# EAGLE design module_ktemp (EAGLE 7.2.0)
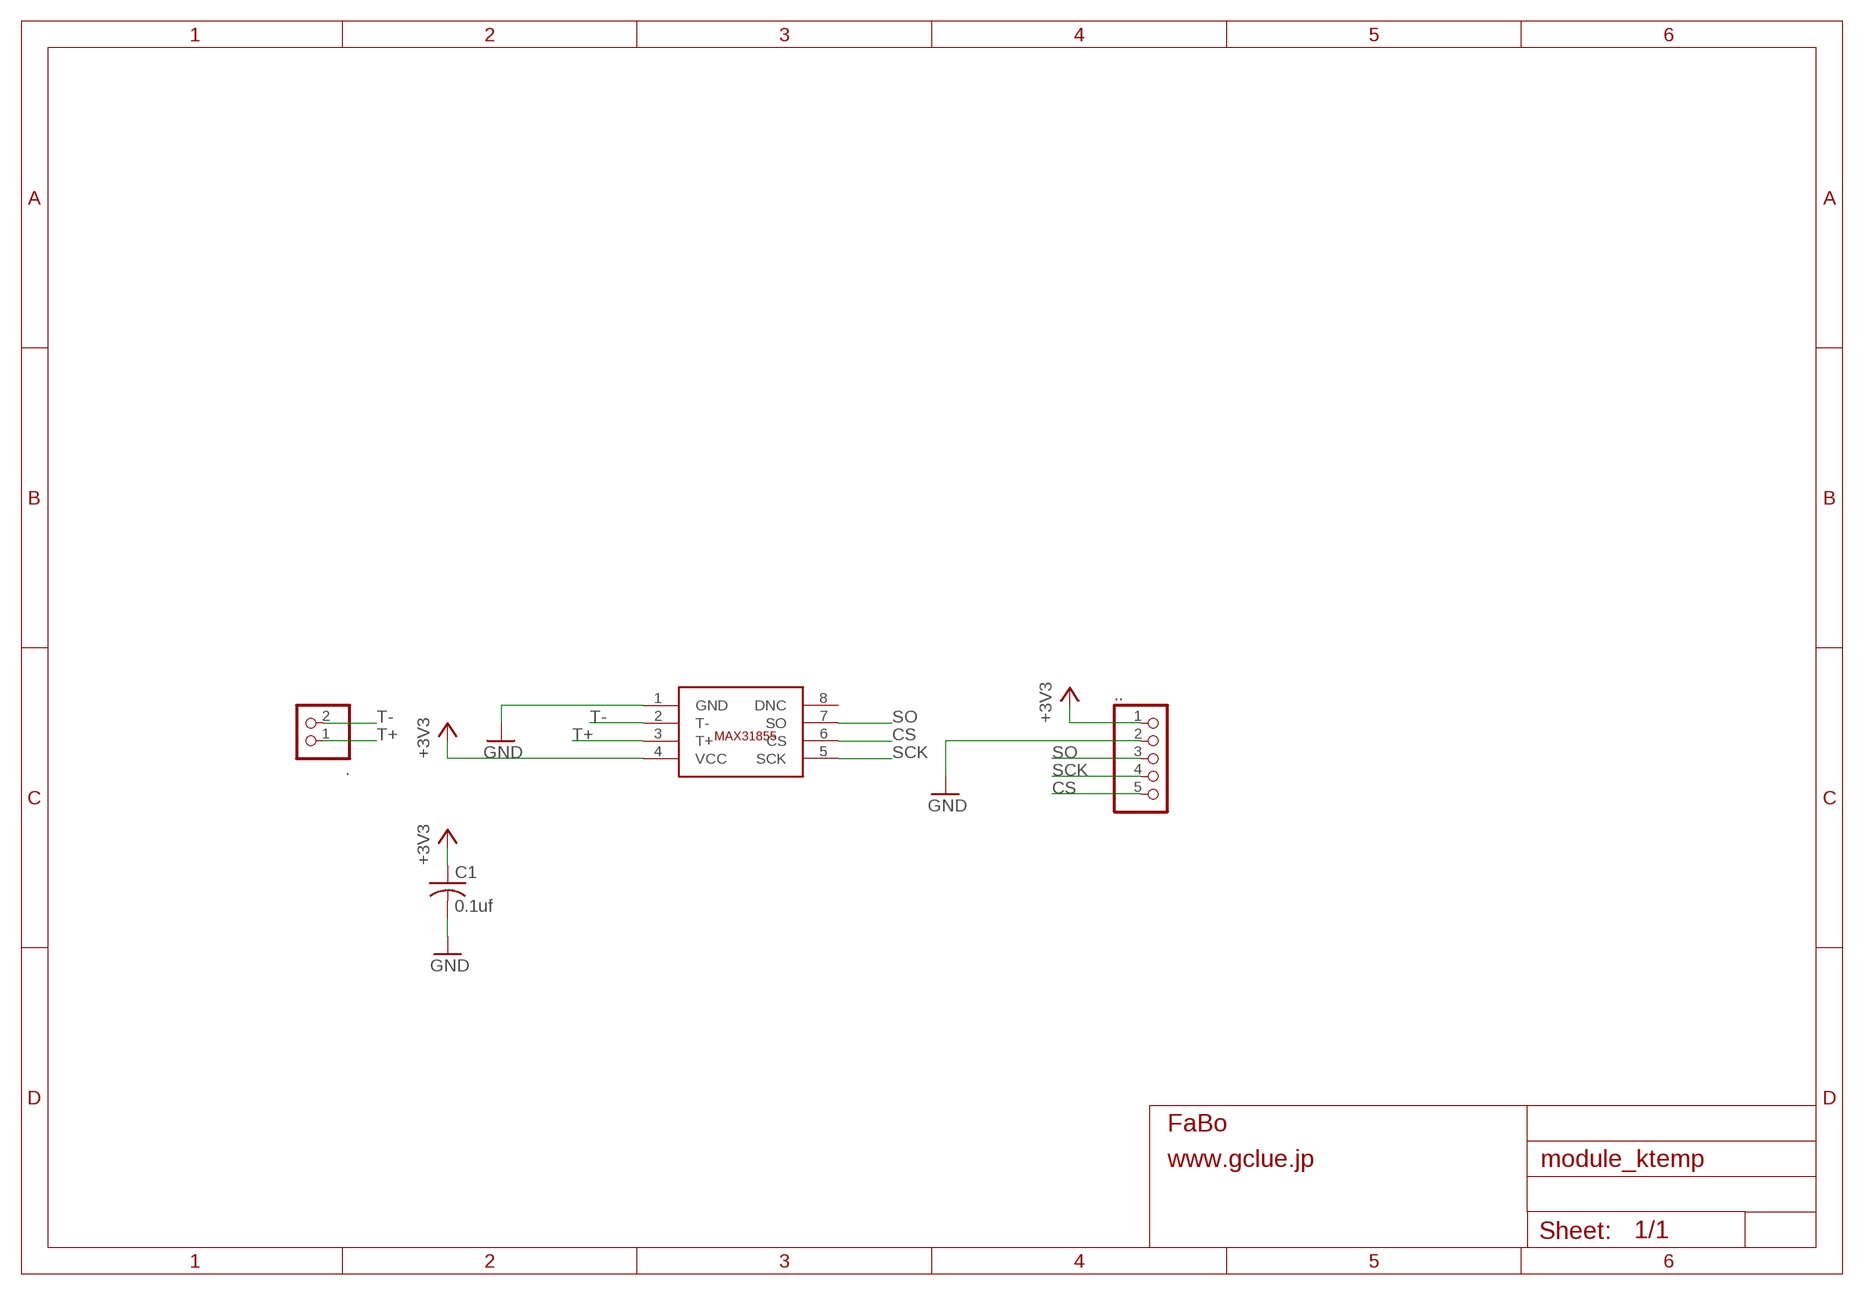
[diagram p0: schematic, sheet 1]

## Parts
.  PINHD-1X2  [1X02]
..  PINHD-1X5  [1X05]
C1  0.1uf  C-USC0603  [C0603]
U$2  MAXIM-MAX31855  [MAXIM-MAX31855]

## Nets
+3V3: ...1 C1.1 U$2.4(VCC)
CS: ...5 U$2.6(CS)
GND: ...2 C1.2 U$2.1(GND)
SCK: ...4 U$2.5(SCK)
SO: ...3 U$2.7(SO)
T+: ..1 U$2.3(T+)
T-: ..2 U$2.2(T-)
Unconnected: U$2.8(DNC)

## Library data of the parts
. = pinhead:PINHD-1X2: PIN HEADER
.. = pinhead:PINHD-1X5: PIN HEADER
C1 = adafruit:C-US: CAPACITOR, American symbol
U$2 = gclueSensor:MAXIM-MAX31855

## Board
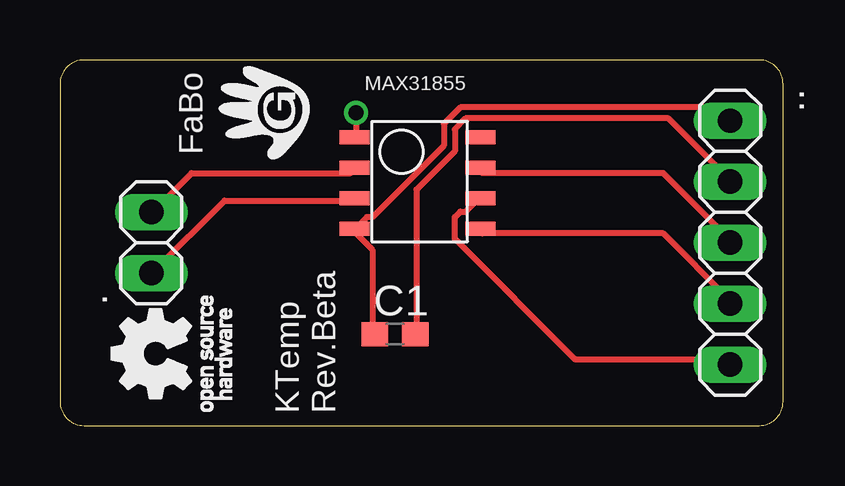
[diagram p1: board, top side]
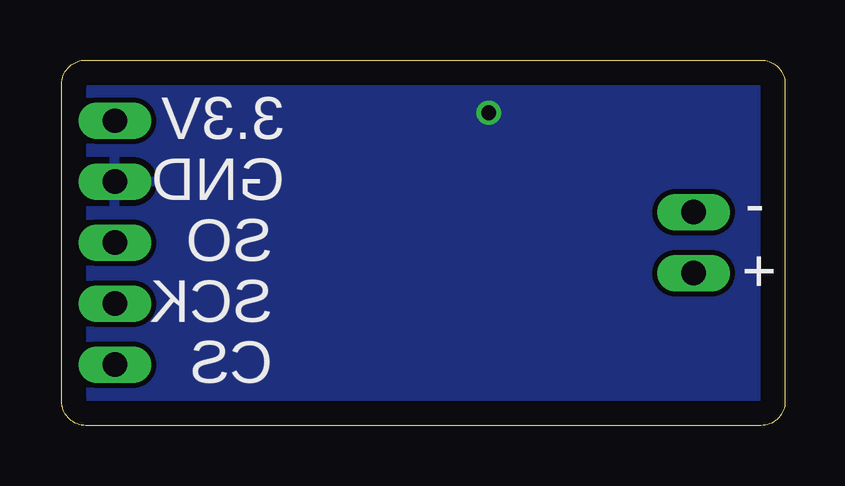
[diagram p2: board, bottom side, seen from below]

Size 30.15 x 15.23 mm. Coordinates in mm from the lower left corner, seen from the top.
Outline: 0,14.23 0,1 arc90 1,0 29.15,0 arc90 30.15,1 30.15,14.23 arc90 29.15,15.23 1,15.23 arc90 0,14.23
Copper layers (1*16): Top 0.035mm / dielectric 1.5mm / Bottom 0.035mm
Design rules "default": minimum track width 10mil, minimum drill 24mil, track to track 8mil, track to pad 8mil, pad to pad 8mil, via to via 8mil, smd to smd 8mil, copper to edge 40mil, drill to drill 8mil, minimum pad ring 10mil, minimum via ring 8mil, stop-mask expansion 4mil, vias tented up to drill 0mil, thermal gap 10mil

### Footprints (pad centres in the part's own frame; a part is rotated, then mirrored left to right if it is on the bottom)
1X02 = drill 1.016 long: 1 -1.27,0; 2 1.27,0
1X05 = drill 1.016 long: 1 -5.08,0; 2 -2.54,0; 3 0,0; 4 2.54,0; 5 5.08,0
C0603 = smd 1.1 x 1: 1 -0.85,0; 2 0.85,0
MAXIM-MAX31855 = smd 1.25 x 0.6: 1 -2.95,1.85; 2 -2.95,0.58; 3 -2.95,-0.69; 4 -2.95,-1.96; 5 2.3,-1.96; 6 2.3,-0.69; 7 2.3,0.58; 8 2.3,1.85

### Placement (x,y rotation side)
.  3.81,7.62 90 top
..  27.94,7.62 270 top
C1  13.97,3.81 0 top
U$2  15.24,10.16 0 top
U$3  [LOGO_OSHW_T_M]  4,3 90 top
U$4  [LOGO_FABO_M]  8.5,13 90 top

### Tracks (layer width: path | path; a pad name or v marks a point on that pad's centre or on a via)
+3V3
  Top 0.254: C1.1 13.03,3.89 13.03,7.32 12.34,8 U$2.4 12.34,8.23 12.8,8.69 13.03,8.69 16,11.66 16,12.57 16.69,13.26 27.43,13.26 27.89,12.8 ...1
CS
  Top 0.254: U$2.6 17.37,9.37 16.92,8.91 16.69,8.91 16.46,8.69 16.46,7.77 21.49,2.74 27.89,2.74 ...5
GND  (via drill 0.61)
  Top 0.254: C1.2 14.86,3.89 14.86,9.83 16.46,11.43 16.46,12.34 16.92,12.8 25.38,12.8 27.89,10.29 ...2 | v12.34,13.03 12.34,12.12 U$2.1
  pour Bottom: 0,-0.5 31,-0.5 31,15.5 0,15.5
SCK
  Top 0.254: U$2.5 17.6,8 25.15,8 27.89,5.26 ...4
SO
  Top 0.254: U$2.7 17.6,10.52 25.15,10.52 27.89,7.77 ...3
T+
  Top 0.254: U$2.3 12.12,9.37 6.86,9.37 3.89,6.4 ..1
T-
  Top 0.254: U$2.2 12.12,10.52 5.49,10.52 3.89,8.91 ..2

### Text on the board
tPlace: KTemp / Rev.Beta
bPlace: 3.3V | GND | - | SO | + | SCK | CS